# EAGLE design IOB-LED-Monitor (EAGLE 7.7.0)
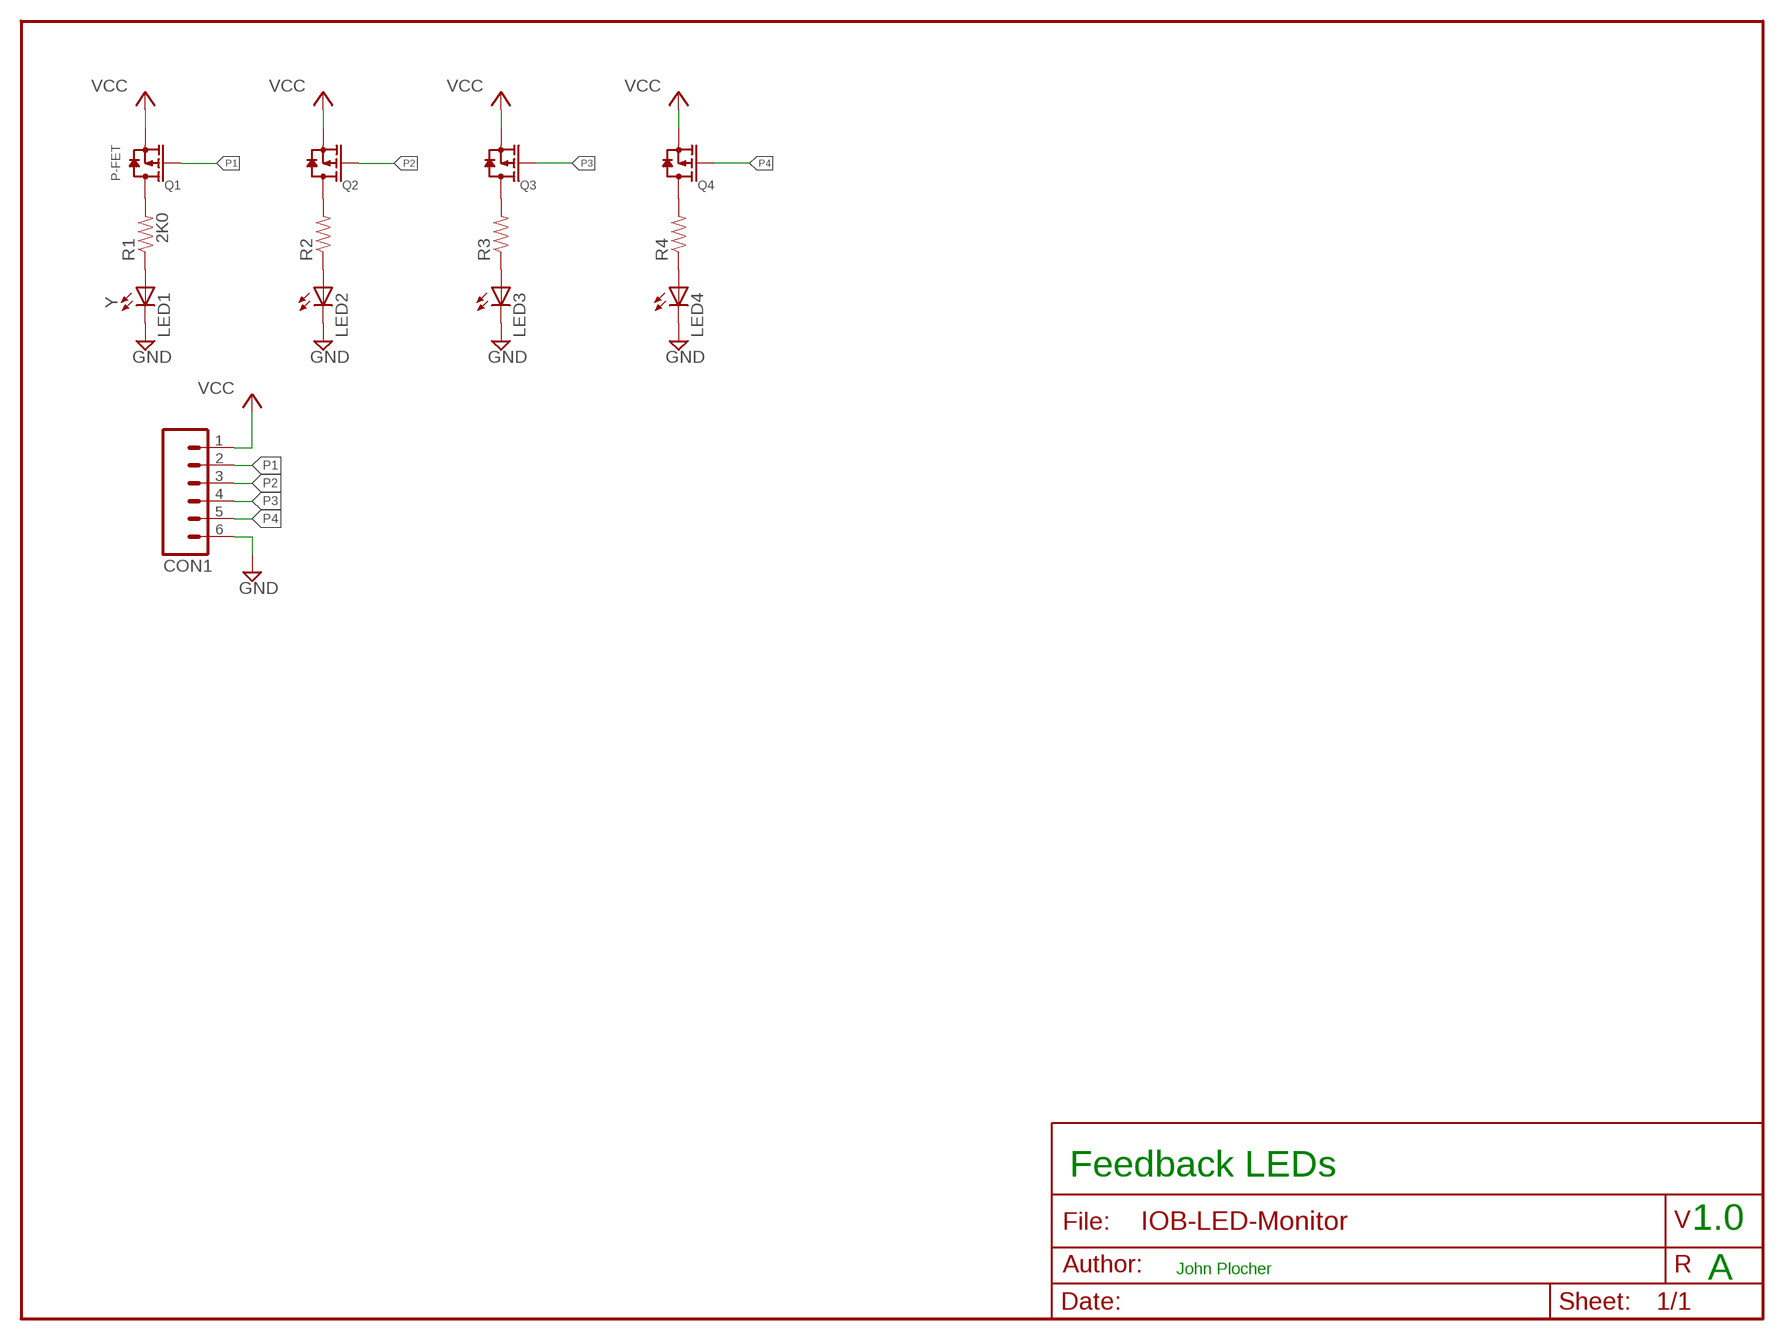
[diagram p0: schematic, sheet 1]

## Parts
CON1  CONNECTOR-M06LOCK  [1X06_LOCK]
LED1  Y  LED0603-LED  [0603-LED]
LED2  Y  LED0603-LED  [0603-LED]
LED3  Y  LED0603-LED  [0603-LED]
LED4  Y  LED0603-LED  [0603-LED]
Q1  P-FET  MOSFET-P-044021001  [SOT23]
Q2  P-FET  MOSFET-P-044021001  [SOT23]
Q3  P-FET  MOSFET-P-044021001  [SOT23]
Q4  P-FET  MOSFET-P-044021001  [SOT23]
R1  2K0  R0805-RES  [0805-RES]
R2  2K0  R0805-RES  [0805-RES]
R3  2K0  R0805-RES  [0805-RES]
R4  2K0  R0805-RES  [0805-RES]

## Nets
GND [Power]: CON1.6 LED1.C LED2.C LED3.C LED4.C
N$44: Q1.3(D) R1.2
N$45: Q2.3(D) R2.2
N$46: Q3.3(D) R3.2
N$47: Q4.3(D) R4.2
N$48: LED1.A R1.1
N$49: LED2.A R2.1
N$50: LED3.A R3.1
N$51: LED4.A R4.1
P1 [signals]: CON1.2 Q1.1(G)
P2 [signals]: CON1.3 Q2.1(G)
P3 [signals]: CON1.4 Q3.1(G)
P4 [signals]: CON1.5 Q4.1(G)
VCC [Power]: CON1.1 Q1.2(S) Q2.2(S) Q3.2(S) Q4.2(S)

## Notes on the sheet
- Feedback LEDs
- 1.0
- John Plocher
- A

## Library data of the parts
CON1 = SPCoast:CONNECTOR-M06: Header 6 Standard 6-pin 0.1" header
LED1-LED4 = SPCoast:LED*
Q1-Q4 = SPCoast:MOSFET-P: CJ2305：SMD MOSFET P-CH 8V-4.1A
R1-R4 = SPCoast:R*: Resistor Basic schematic elements and footprints for 0603, 1206, and PTH 1/10th watt (small) resistors.

## Net classes
0 default: width 0.254 mm, drill 0.4 mm, clearance 0.127 mm
1 Power: width 0.254 mm, drill 0.4 mm, clearance 0.127 mm
2 signals: width 0.254 mm, drill 0.4 mm, clearance 0.127 mm

## Board
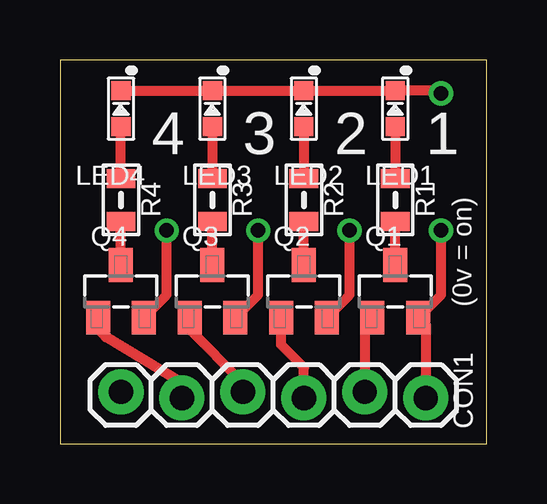
[diagram p1: board, top side]
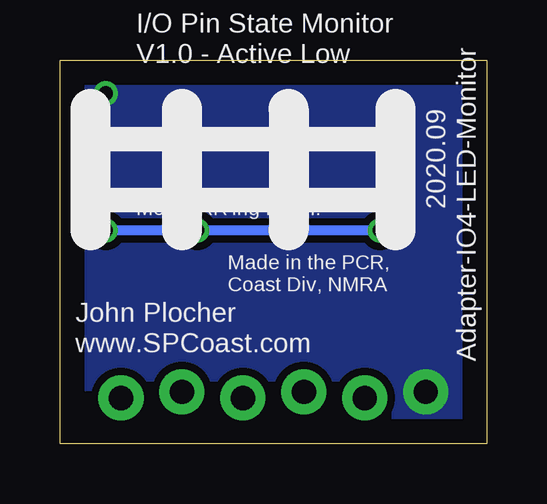
[diagram p2: board, bottom side, seen from below]

Size 17.78 x 16 mm. Coordinates in mm from the lower left corner, seen from the top.
Outline: 0,0 17.78,0 17.78,16 0,16 0,0
Copper layers (1*16): Top 0.035mm / dielectric 1.5mm / Bottom 0.035mm
Design rules "default": minimum track width 10mil, minimum drill 0.6mm, track to track 8mil, track to pad 8mil, pad to pad 8mil, via to via 8mil, smd to smd 8mil, copper to edge 40mil, drill to drill 8mil, minimum pad ring 10mil, minimum via ring 8mil, stop-mask expansion 4mil, vias tented up to drill 0mil, thermal gap 10mil

### Footprints (pad centres in the part's own frame; a part is rotated, then mirrored left to right if it is on the bottom)
1X06_LOCK = drill 1.016 pad 1.88: 1 0,0; 2 2.54,-0.254; 3 5.08,0; 4 7.62,-0.254; 5 10.16,0; 6 12.7,-0.254
0603-LED = smd 0.8 x 0.8: A 0.75,0; C -0.75,0
SOT23 = smd 1.4 x 1: 1 1.1,-0.95; 2 1.1,0.95; 3 -1.1,0
0805-RES = smd 0.8 x 1.2: 1 -0.9,0; 2 0.9,0

### Placement (x,y rotation side)
CON1  15.24,1.91 180 top
LED1  13.97,13.97 270 top
LED2  10.16,13.97 270 top
LED3  6.35,13.97 270 top
LED4  2.54,13.97 270 top
Q1  13.97,6.35 270 top
Q2  10.16,6.35 270 top
Q3  6.35,6.35 270 top
Q4  2.54,6.35 270 top
R1  13.97,10.16 270 top
R2  10.16,10.16 270 top
R3  6.35,10.16 270 top
R4  2.54,10.16 270 top

### Tracks (layer width: path | path; a pad name or v marks a point on that pad's centre or on a via)
GND  (via drill 0.6)
  Top 0.406: LED4.C LED3.C LED2.C LED1.C 15.76,14.72 v15.88,14.61
  pour Bottom (isolate 0.305, no thermals): 0.64,0.64 0.64,15.88 17.14,15.88 17.14,0.64
N$44
  Top 0.406: Q1.3 R1.2
N$45
  Top 0.406: Q2.3 R2.2
N$46
  Top 0.406: Q3.3 R3.2
N$47
  Top 0.406: Q4.3 R4.2
N$48
  Top 0.406: LED1.A R1.1
N$49
  Top 0.406: LED2.A R2.1
N$50
  Top 0.406: LED3.A R3.1
N$51
  Top 0.406: R4.1 LED4.A
P1
  Top 0.406: Q1.1 12.7,4.93 CON1.2
P2
  Top 0.406: CON1.3 10.16,3.17 9.21,4.12 Q2.1
P3
  Top 0.406: CON1.4 7.62,2.54 5.4,4.76 Q3.1
P4
  Top 0.406: CON1.5 5.08,2.54 1.91,4.45 1.59,4.76 Q4.1
VCC  (via drill 0.6)
  Top 0.406: v15.88,8.89 15.88,6.21 Q1.2 15.24,4.93 CON1.1 | Q2.2 12.06,6.21 v12.06,8.89 | Q3.2 8.26,6.21 v8.26,8.89 | Q4.2 4.45,6.21 v4.45,8.89
  Bottom 0.406: v4.45,8.89 v8.26,8.89 v12.06,8.89 v15.88,8.89

### Text on the board
tPlace: 4 | 3 | 2 | 1 | (0v = on)
bPlace: Adapter-IO4-LED-Monitor | I/O Pin State Monitor | V1.0 - Active Low | 2020.09 | Model RR'ing is fun! | Made in the PCR, / Coast Div, NMRA | John Plocher | www.SPCoast.com
_tNames: LED4 | R4 | LED3 | R3 | LED2 | R2 | LED1 | R1 | Q4 | Q3 | Q2 | Q1 | CON1